# EAGLE design rgbled (EAGLE 7.7.0)
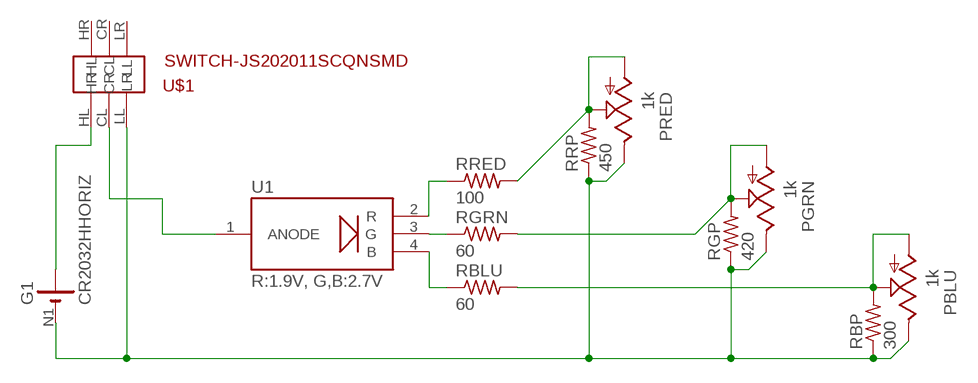
[diagram p0: schematic, sheet 1]

## Parts
G1  CR2032HHORIZ  [LINX-BAT-HLD-001]
PBLU  1k  TRIM_US-PTV111-1  [PTV111-1]
PGRN  1k  TRIM_US-PTV111-1  [PTV111-1]
PRED  1k  TRIM_US-PTV111-1  [PTV111-1]
RBLU  60  R-US_M0805  [M0805]
RBP  300  R-US_R0805  [R0805]
RGP  420  R-US_R0805  [R0805]
RGRN  60  R-US_M0805  [M0805]
RRED  100  R-US_M0805  [M0805]
RRP  450  R-US_R0805  [R0805]
U1  R:1.9V, G,B:2.7V  LRTB_R48GSMD  [LRTB_R48G]
U$1  SWITCH-JS202011SCQNSMD  [SWITCH-JS202011CQN]

## Nets
N$2: U1.1(ANODE) U$1.CL
N$3: RRED.1 U1.2(R)
N$4: RGRN.1 U1.3(G)
N$5: RBLU.1 U1.4(B)
N$6: PGRN.2(S) PGRN.3(A) RGP.2 RGRN.2
N$8: PBLU.2(S) PBLU.3(A) RBLU.2 RBP.2
N$10: G1.P@1(+) G1.P@2(+) U$1.HL
N$11: G1.N1(-) PBLU.1(E) PGRN.1(E) PRED.1(E) RBP.1 RGP.1 RRP.1 U$1.LL
RRP: PRED.2(S) PRED.3(A) RRED.2 RRP.2
Unconnected: U$1.CR U$1.HR U$1.LR

## Library data of the parts
G1 = mattsownlib:CR2032H: LI BATTERY Varta
PBLU PGRN PRED = mattsownlib:TRIM_US-: POTENTIOMETER
RBLU RGRN RRED = resistor:R-US_: RESISTOR, American symbol
RBP RGP RRP = rcl:R-US_: RESISTOR, American symbol
U1 = mattsownlib:LRTB_R48G
U$1 = mattsownlib:SWITCH-JS202011SCQN

## Board
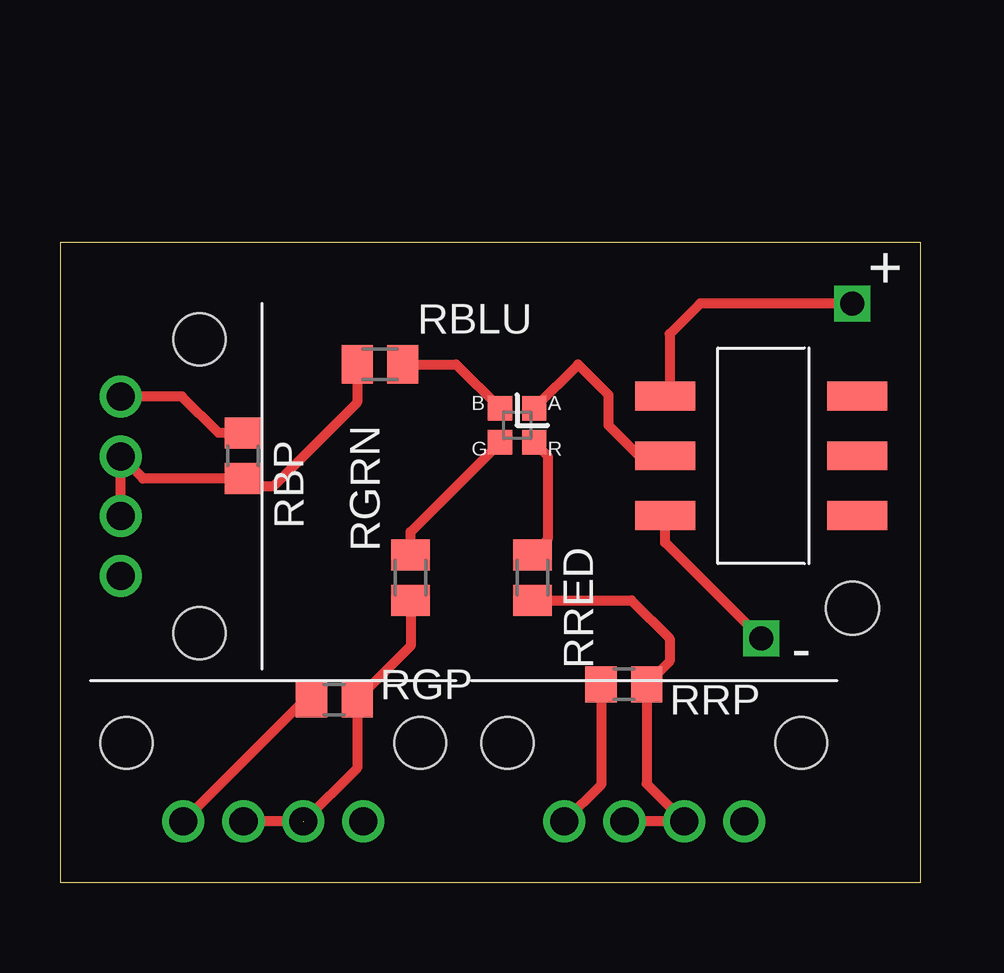
[diagram p1: board, top side]
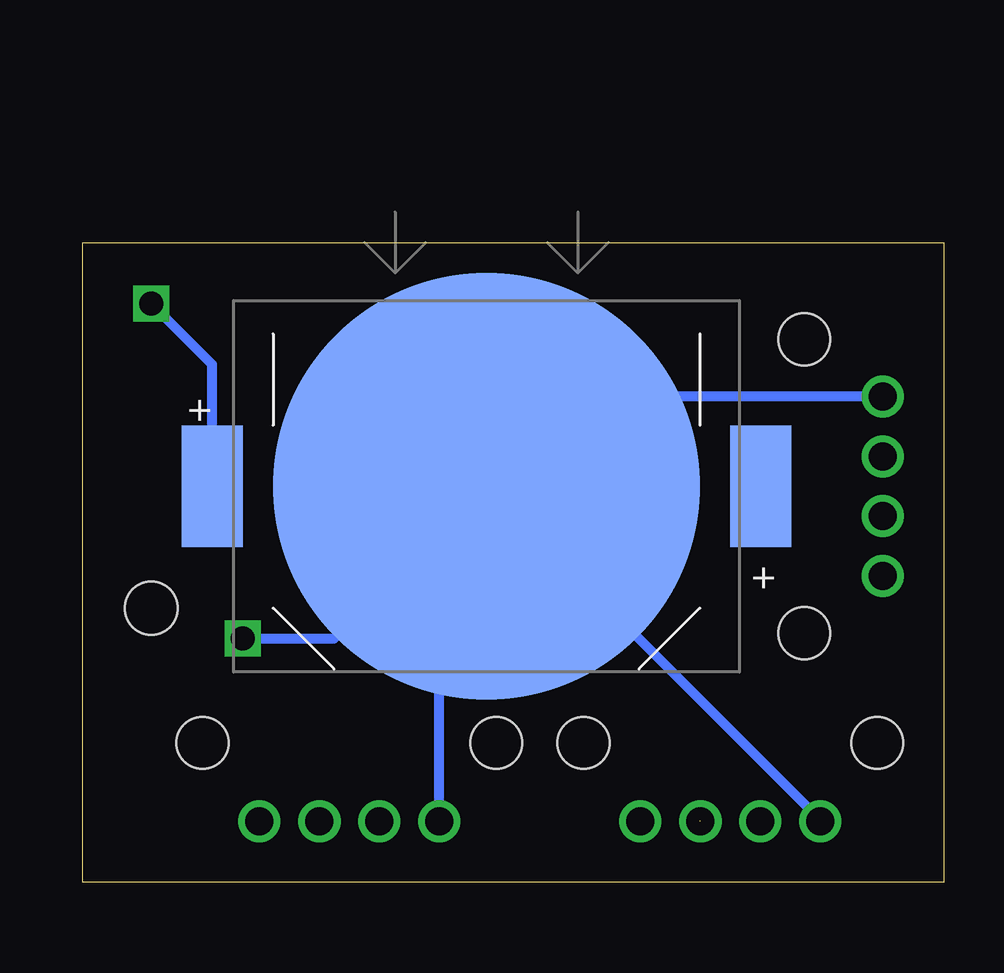
[diagram p2: board, bottom side, seen from below]

Size 35.86 x 26.66 mm. Coordinates in mm from the lower left corner, seen from the top.
Outline: 0,0 35.86,0 35.86,26.66 0,26.66 0,0
Copper layers (1*16): Top 0.035mm / dielectric 1.5mm / Bottom 0.035mm
Design rules "default": minimum track width 10mil, minimum drill 24mil, track to track 8mil, track to pad 8mil, pad to pad 8mil, via to via 8mil, smd to smd 8mil, copper to edge 40mil, drill to drill 8mil, minimum pad ring 10mil, minimum via ring 8mil, stop-mask expansion 4mil, vias tented up to drill 0mil, thermal gap 10mil
Holes 2.2 mm at 33.02,11.43

### Footprints (pad centres in the part's own frame; a part is rotated, then mirrored left to right if it is on the bottom)
LINX-BAT-HLD-001 = smd 17.78 x 17.78: N1 0,0 | smd 2.54 x 5.08: P@1 -11.43,0; P@2 11.43,0
PTV111-1 = drill 1.168: 1 -3.747,0; 2 -1.245,0; 3 1.245,0; 4 3.747,0 | hole 2.159: -6.121,3.277; 6.121,3.277
M0805 = smd 1.3 x 1.6: 1 -0.95,0; 2 0.95,0
R0805 = smd 1.3 x 1.5: 1 -0.95,0; 2 0.95,0
LRTB_R48G = smd 1.016 x 1.016: 1 0.711,0.711; 2 0.711,-0.711; 3 -0.711,-0.711; 4 -0.711,0.711
SWITCH-JS202011CQN = smd 1.194 x 2.502: CL 0,-4; CR 0,4; HL -2.489,-4; HR -2.489,4; LL 2.489,-4; LR 2.489,4

### Placement (x,y rotation side)
G1  19.05,16.51 180 bottom
PBLU  2.54,16.51 270 top
PGRN  8.89,2.54 0 top
PRED  24.77,2.54 0 top
RBLU  13.34,21.59 180 top
RBP  7.62,17.78 270 top
RGP  11.43,7.62 0 top
RGRN  14.61,12.7 270 top
RRED  19.68,12.7 270 top
RRP  23.5,8.25 0 top
U1  19.05,19.05 0 top
U$1  29.21,17.78 270 top

### Tracks (layer width: path | path; a pad name or v marks a point on that pad's centre or on a via)
N$2
  Top 0.406: U$1.CL 24.13,17.78 22.86,19.05 22.86,20.32 21.59,21.59 U1.1
N$3
  Top 0.406: U1.2 20.32,17.78 20.32,14.28 RRED.1
N$4
  Top 0.406: RGRN.1 14.61,14.61 U1.3
N$5
  Top 0.406: RBLU.1 16.51,21.59 U1.4
N$6  (1 unrouted)
  Top 0.406: PGRN.3 PGRN.2 | RGRN.2 14.61,9.84 RGP.2 12.38,4.76 10.16,2.54
N$8
  Top 0.406: PBLU.3 PBLU.2 3.47,16.83 RBP.2 7.94,16.51 8.89,16.51 12.38,20 RBLU.2
N$10  (via drill 1)
  Top 0.406: v33.02,24.13 26.67,24.13 25.4,22.86 25.4,20.46 U$1.HL
  Bottom 0.406: G1.P@2 30.48,21.59 v33.02,24.13
N$11  (via drill 1)
  Top 0.406: v29.21,10.16 25.21,14.16 U$1.LL | RBP.1 6.61,18.73 5.08,20.26 PBLU.1 | RGP.1 10.22,7.62 PGRN.1 | RRP.1 22.55,4.07 PRED.1
  Bottom 0.406: v29.21,10.16 25.4,10.16 21.02,14.54 | G1.N1 19.05,20.32 18.99,20.26 PBLU.1 | PRED.1 21.02,14.54 | 21.02,14.54 G1.N1 | PGRN.1 5.14,2.6 G1.N1
RRP
  Top 0.406: PRED.2 PRED.3 24.45,4.11 RRP.2 25.4,9.21 25.4,10.16 23.81,11.75 RRED.2

### Text on the board
tPlace: + | -